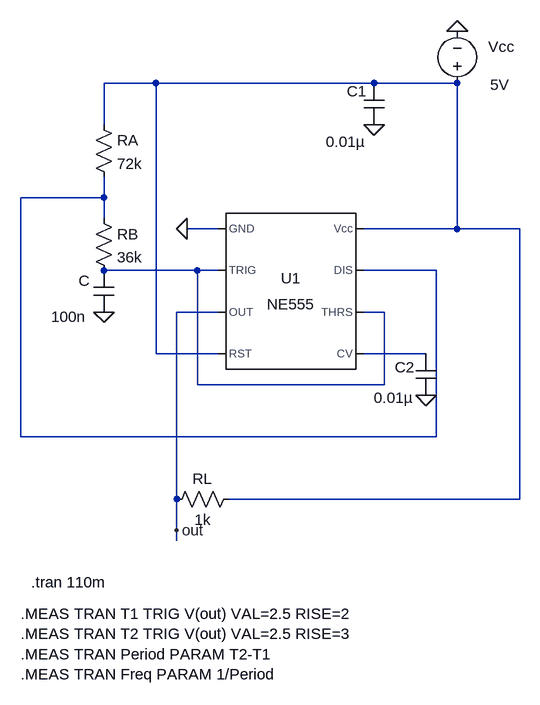
[diagram p0: schematic BAI 5 THUC HANH 3.asc]
BAI 5 THUC HANH 3.asc, the LTspice schematic file:
Version 4.1
SHEET 1 880 724
WIRE 96 -192 16 -192
WIRE 432 -192 96 -192
WIRE 560 -192 432 -192
WIRE 16 -128 16 -192
WIRE 16 -16 16 -48
WIRE 16 -16 -112 -16
WIRE 16 16 16 -16
WIRE 192 32 144 32
WIRE 560 32 560 -192
WIRE 560 32 416 32
WIRE 656 32 560 32
WIRE 160 96 16 96
WIRE 192 96 160 96
WIRE 528 96 416 96
WIRE 192 160 128 160
WIRE 448 160 416 160
WIRE 96 224 96 -192
WIRE 192 224 96 224
WIRE 512 224 416 224
WIRE 160 272 160 96
WIRE 448 272 448 160
WIRE 448 272 160 272
WIRE -112 352 -112 -16
WIRE 528 352 528 96
WIRE 528 352 -112 352
WIRE 128 448 128 160
WIRE 656 448 656 32
WIRE 656 448 208 448
WIRE 128 496 128 448
WIRE 128 512 128 496
FLAG 144 32 0
FLAG 16 160 0
FLAG 432 -128 0
FLAG 128 496 out
FLAG 560 -272 0
FLAG 512 288 0
SYMBOL Misc\\NE555 304 128 R0
SYMATTR InstName U1
SYMBOL res 0 0 R0
SYMATTR InstName RB
SYMATTR Value 36k
SYMBOL cap 0 96 R0
WINDOW 0 -23 16 Left 2
WINDOW 3 -65 71 Left 2
SYMATTR InstName C
SYMATTR Value 100n
SYMBOL res 0 -144 R0
SYMATTR InstName RA
SYMATTR Value 72k
SYMBOL cap 416 -192 R0
WINDOW 0 -26 12 Left 2
WINDOW 3 -58 90 Left 2
SYMATTR InstName C1
SYMATTR Value 0.01µ
SYMBOL res 224 432 R90
WINDOW 0 0 56 VBottom 2
WINDOW 3 32 56 VTop 2
SYMATTR InstName RL
SYMATTR Value 1k
SYMBOL voltage 560 -176 R180
WINDOW 0 -88 72 Left 2
WINDOW 3 -80 14 Left 2
SYMATTR InstName Vcc
SYMATTR Value 5V
SYMBOL cap 496 224 R0
WINDOW 0 -32 21 Left 2
WINDOW 3 -64 68 Left 2
SYMATTR InstName C2
SYMATTR Value 0.01µ
TEXT -96 576 Left 2 !.tran 110m
TEXT -112 624 Left 2 !.MEAS TRAN T1 TRIG V(out) VAL=2.5 RISE=2\n.MEAS TRAN T2 TRIG V(out) VAL=2.5 RISE=3\n.MEAS TRAN Period PARAM T2-T1\n.MEAS TRAN Freq PARAM 1/Period

The netlist it stands for:
* BAI 5 THUC HANH 3.asc
X§U1 0 N003 out N001 N004 N003 N002 N001 NE555  ; pins GND TRIG OUT RST CV THRS DIS Vcc
RB N002 N003 36k
C N003 0 100n
RA N001 N002 72k
C1 N001 0 0.01µ
RL N001 out 1k
Vcc N001 0 5V
C2 N004 0 0.01µ
.tran 110m
.MEAS TRAN T1 TRIG V(out) VAL=2.5 RISE=2
.MEAS TRAN T2 TRIG V(out) VAL=2.5 RISE=3
.MEAS TRAN Period PARAM T2-T1
.MEAS TRAN Freq PARAM 1/Period
.lib NE555.sub
.backanno
.end